# Altium schematic sheet PushButtonGreen.SchDoc
size B
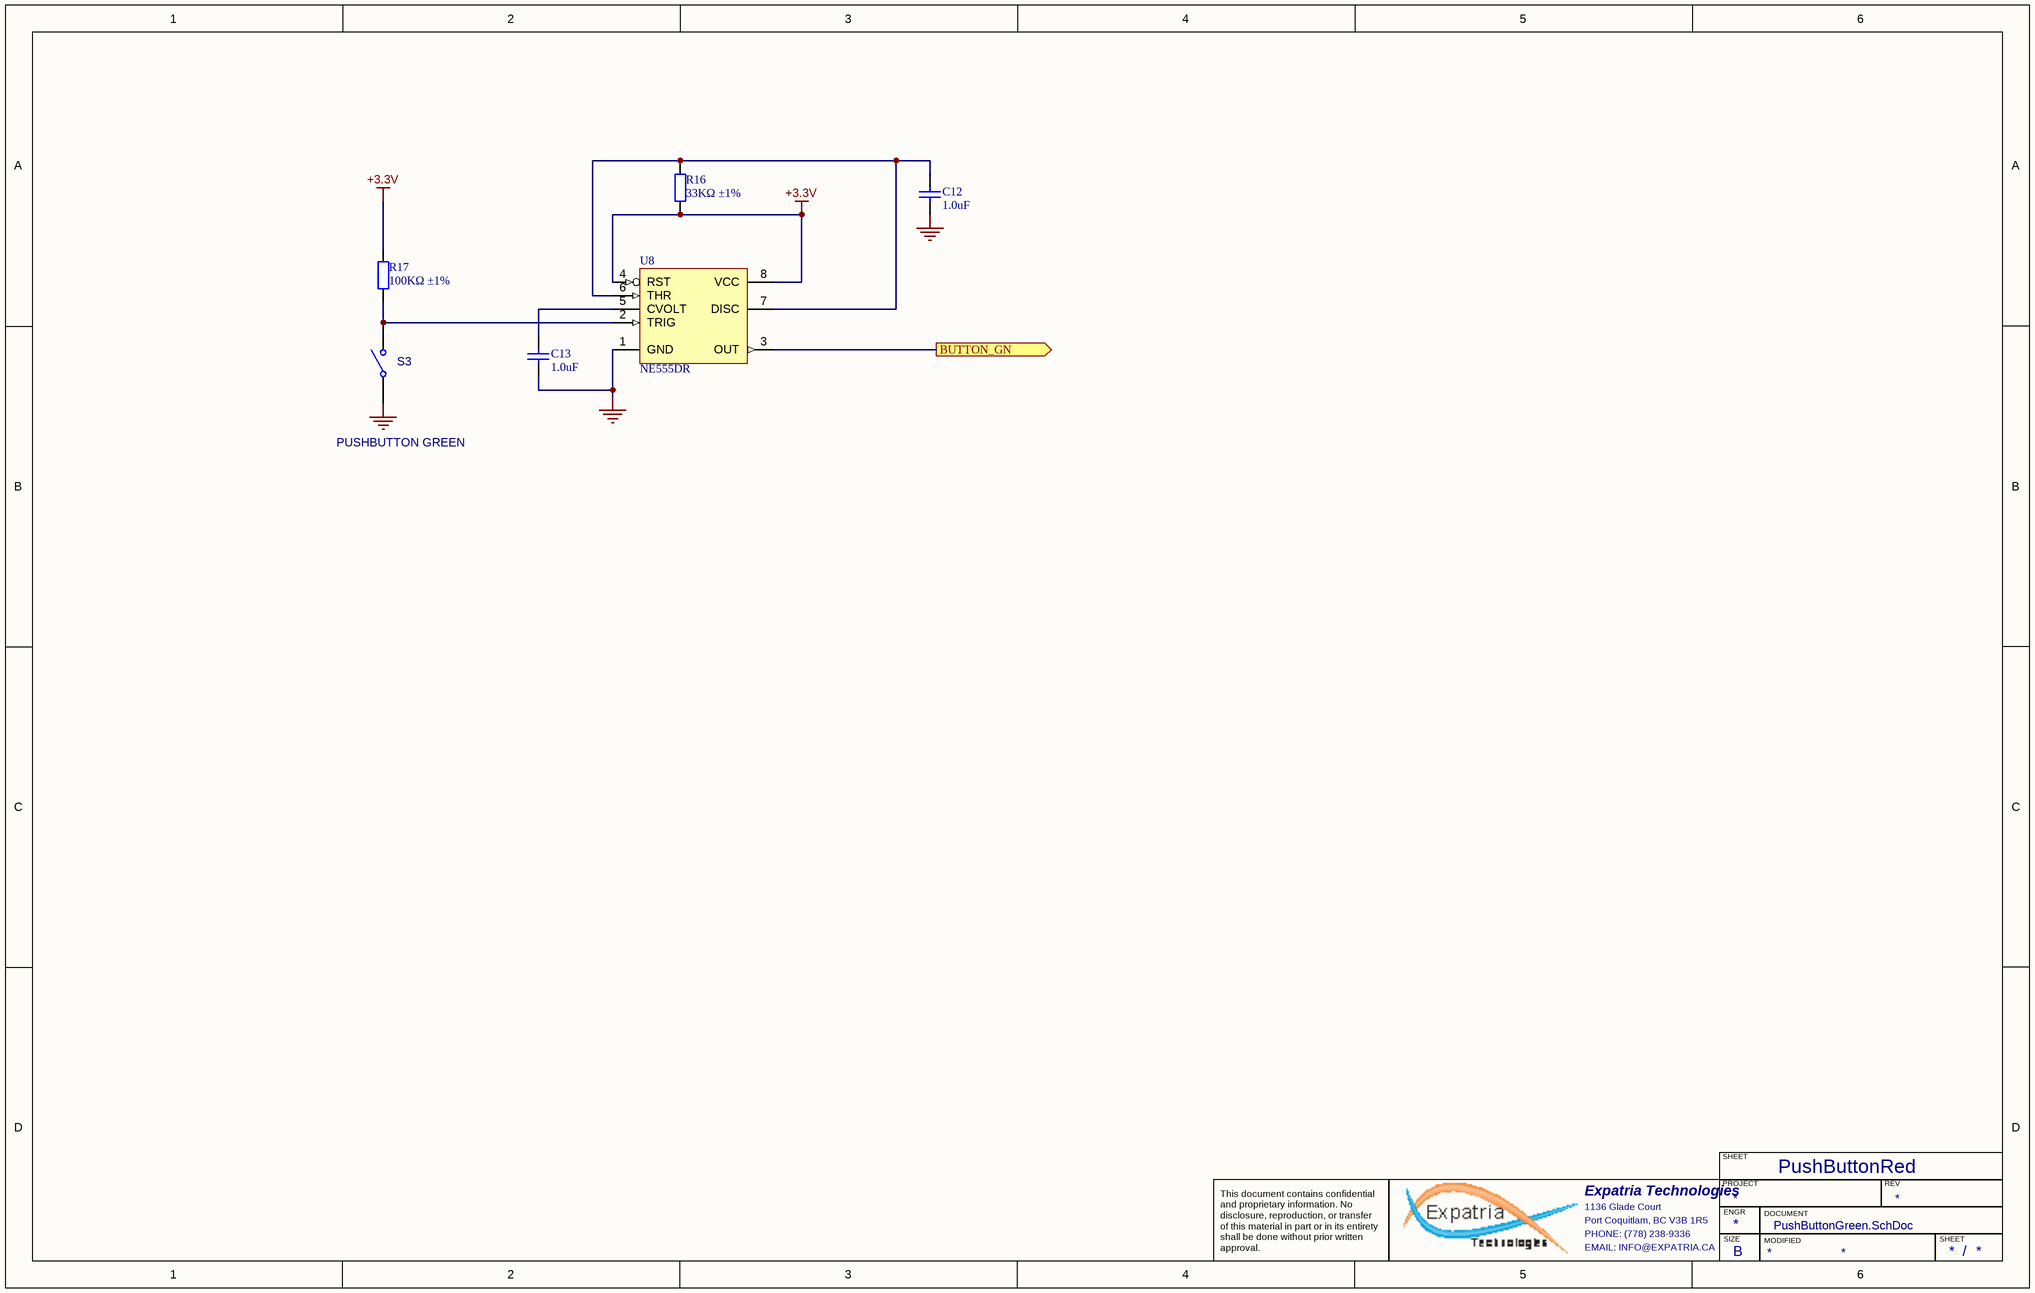
[diagram p0: PushButtonGreen.SchDoc]

## Parts
C12  1.0uF  [0402_C]
C13  1.0uF  [0402_C]
R16  33KΩ ±1%  [0402_R]
R17  100KΩ ±1%  [0402_R]
S3  PUSHBUTTON GREEN  [D6C10F1LFS _GREEN]
U8  NE555DR  [SOIC-8_150mil]

## Ports
BUTTON_GN (out)

## Nets
+3.3V: R16.1 R17.2 U8.4(RST) U8.8(VCC)
GND: C12.1 C13.2 S3.1(COMMON) U8.1(GND)
BUTTON_GN: U8.3(OUT) ; port BUTTON_GN
NetC12_2: C12.2 R16.2 U8.6(THR) U8.7(DISC)
NetC13_1: C13.1 U8.5(CVOLT)
NetR17_1: R17.1 S3.2(NO) U8.2(TRIG)

## Notes on the sheet
- PushButtonRed
- SHEET
- Expatria Technologies
- 1136 Glade Court
- Port Coquitlam, BC V3B 1R5
- PHONE: (778) 238-9336
- PROJECT
- SIZE
- ENGR
- MODIFIED
- DOCUMENT
- REV
- This document contains confidential and proprietary information. No disclosure, reproduction, or transfer of this material in part or in its entirety shall be done without prior written approval.
- EMAIL: INFO@EXPATRIA.CA
- B
- /

## Library data of the parts
C12 C13 = 0402 1.0uF (105) 10% 25V: Chip capacitor; Manufacturer: Samsung Electro-Mechanics; PartNumber: CL05A105KA5NQNC; Capacitance: 1uF; Tolerance: 10%; Voltage: 25V; ComponentLink1Description: Supplier link; ComponentLink1URL: http://www.szlcsc.com/product/details_53938.html; Package: 0402; Supplier: LC; SuppliersPartNumber: C52923
R16 = 0402 33K (3302) 1%: Chip resistor; Manufacturer: Uniroyal Elec; PartNumber: 0402WGF3302TCE; Power: 1/16W; ComponentLink1Description: Supplier link; ComponentLink1URL: http://www.szlcsc.com/product/details_26522.html; Package: 0402; Supplier: LC; SuppliersPartNumber: C25779; Resistance: 33KΩ; Tolerance: 1%
R17 = 0402 100K (1003) 1%: Chip resistor; Manufacturer: Uniroyal Elec; PartNumber: 0402WGF1003TCE; Power: 1/16W; ComponentLink1Description: Supplier link; ComponentLink1URL: http://www.szlcsc.com/product/details_26484.html; Package: 0402; Supplier: LC; SuppliersPartNumber: C25741; Resistance: 100KΩ; Tolerance: 1%
S3 = D6R40 F1 LFS: SWITCH PUSH SPST-NO 0.1A 32V RED; Manufacturer 1: C&K; Value: BUTTON RED; Manufacturer Part Number 1: D6R40 F1 LFS; Supplier 1: Digi-Key; Supplier Part Number 1: 401-1975-ND
U8 = NE555DR_[C7593]: 时基集成; ComponentLink1Description: 供应商链接; ComponentLink1URL: http://www.szlcsc.com/product/details_8070.html; Package: SOIC-8_150mil; Supplier: LC; SuppliersPartNumber: C7593